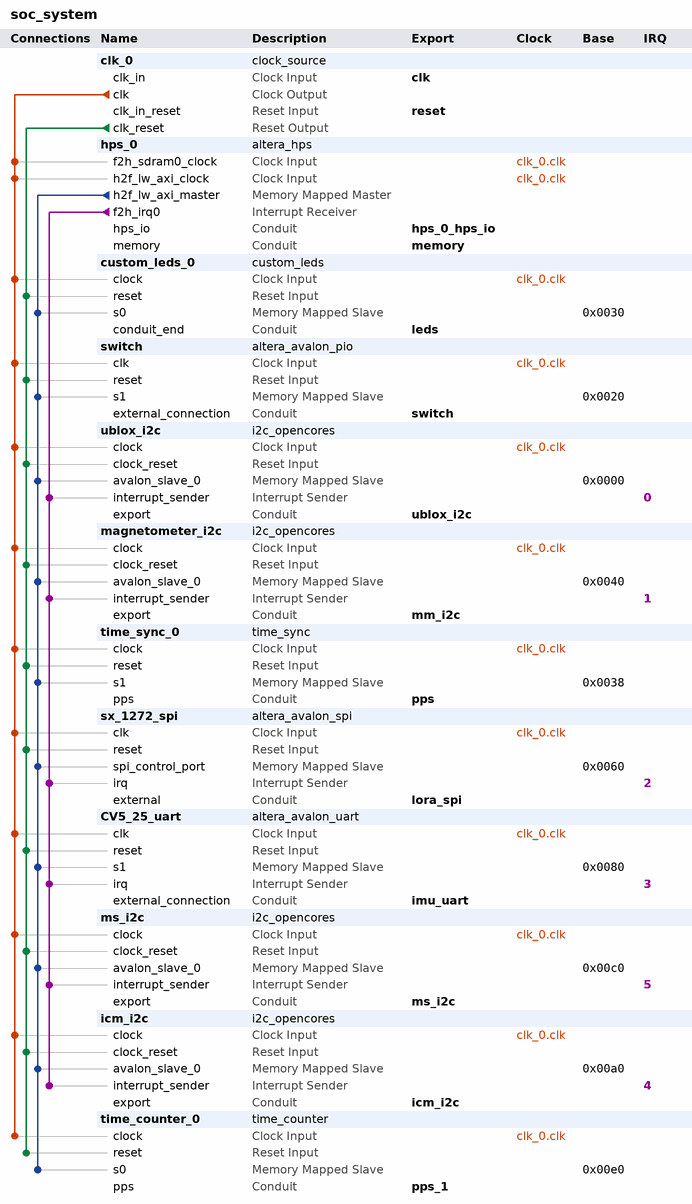
[diagram p0: system contents]
# Platform Designer (Qsys) system soc_system, Cyclone V 5CSEBA6U23I7
# Parameters at their usual value, and those the tool derives, are not listed.
package require -exact qsys 18.1
create_system soc_system
set_project_property DEVICE_FAMILY {Cyclone V}
set_project_property DEVICE 5CSEBA6U23I7

add_instance clk_0 clock_source 18.1
set_instance_parameter_value clk_0 clockFrequency 50000000

add_instance hps_0 altera_hps 18.1
set_instance_parameter_value hps_0 EMAC1_Mode RGMII
set_instance_parameter_value hps_0 EMAC1_PinMuxing {HPS I/O Set 0}
set_instance_parameter_value hps_0 F2SCLK_COLDRST_Enable false
set_instance_parameter_value hps_0 F2SCLK_DBGRST_Enable false
set_instance_parameter_value hps_0 F2SCLK_WARMRST_Enable false
set_instance_parameter_value hps_0 F2SDRAM_Type {Avalon-MM Bidirectional}
set_instance_parameter_value hps_0 F2SDRAM_Width 256
set_instance_parameter_value hps_0 F2SINTERRUPT_Enable true
set_instance_parameter_value hps_0 F2S_Width 0
set_instance_parameter_value hps_0 FPGA_PERIPHERAL_OUTPUT_CLOCK_FREQ_EMAC0_GTX_CLK 100
set_instance_parameter_value hps_0 FPGA_PERIPHERAL_OUTPUT_CLOCK_FREQ_EMAC0_MD_CLK 100.0
set_instance_parameter_value hps_0 FPGA_PERIPHERAL_OUTPUT_CLOCK_FREQ_EMAC1_GTX_CLK 100
set_instance_parameter_value hps_0 FPGA_PERIPHERAL_OUTPUT_CLOCK_FREQ_EMAC1_MD_CLK 100.0
set_instance_parameter_value hps_0 HPS_PROTOCOL DDR3
set_instance_parameter_value hps_0 I2C0_Mode N/A
set_instance_parameter_value hps_0 I2C0_PinMuxing Unused
set_instance_parameter_value hps_0 I2C1_Mode N/A
set_instance_parameter_value hps_0 I2C1_PinMuxing Unused
set_instance_parameter_value hps_0 LWH2F_Enable true
set_instance_parameter_value hps_0 MEM_BANKADDR_WIDTH 3
set_instance_parameter_value hps_0 MEM_CLK_FREQ 400.0
set_instance_parameter_value hps_0 MEM_COL_ADDR_WIDTH 10
set_instance_parameter_value hps_0 MEM_DQ_WIDTH 32
set_instance_parameter_value hps_0 MEM_DRV_STR RZQ/6
set_instance_parameter_value hps_0 MEM_ROW_ADDR_WIDTH 15
set_instance_parameter_value hps_0 MEM_RTT_NOM RZQ/6
set_instance_parameter_value hps_0 MEM_RTT_WR {Dynamic ODT off}
set_instance_parameter_value hps_0 MEM_TCL 7
set_instance_parameter_value hps_0 MEM_TFAW_NS 37.5
set_instance_parameter_value hps_0 MEM_TRAS_NS 35.0
set_instance_parameter_value hps_0 MEM_TRCD_NS 13.75
set_instance_parameter_value hps_0 MEM_TRFC_NS 300.0
set_instance_parameter_value hps_0 MEM_TRP_NS 13.75
set_instance_parameter_value hps_0 MEM_VENDOR Other
set_instance_parameter_value hps_0 MEM_WTCL 7
set_instance_parameter_value hps_0 QSPI_Mode N/A
set_instance_parameter_value hps_0 QSPI_PinMuxing Unused
set_instance_parameter_value hps_0 REF_CLK_FREQ 25.0
set_instance_parameter_value hps_0 S2FCLK_USER2CLK 4
set_instance_parameter_value hps_0 S2F_Width 0
set_instance_parameter_value hps_0 SDIO_Mode {4-bit Data}
set_instance_parameter_value hps_0 SDIO_PinMuxing {HPS I/O Set 0}
set_instance_parameter_value hps_0 SPIM1_Mode N/A
set_instance_parameter_value hps_0 SPIM1_PinMuxing Unused
set_instance_parameter_value hps_0 STM_Enable false
set_instance_parameter_value hps_0 TIMING_BOARD_AC_SKEW 0.02
set_instance_parameter_value hps_0 TIMING_BOARD_AC_TO_CK_SKEW 0.0
set_instance_parameter_value hps_0 TIMING_BOARD_DQ_TO_DQS_SKEW 0.0
set_instance_parameter_value hps_0 TIMING_BOARD_MAX_CK_DELAY 0.6
set_instance_parameter_value hps_0 TIMING_BOARD_MAX_DQS_DELAY 0.6
set_instance_parameter_value hps_0 TIMING_BOARD_SKEW_BETWEEN_DQS 0.02
set_instance_parameter_value hps_0 TIMING_BOARD_SKEW_CKDQS_DIMM_MAX 0.01
set_instance_parameter_value hps_0 TIMING_BOARD_SKEW_CKDQS_DIMM_MIN -0.01
set_instance_parameter_value hps_0 TIMING_BOARD_SKEW_WITHIN_DQS 0.02
set_instance_parameter_value hps_0 TIMING_TDH 125
set_instance_parameter_value hps_0 TIMING_TDQSCK 400
set_instance_parameter_value hps_0 TIMING_TDQSQ 120
set_instance_parameter_value hps_0 TIMING_TDS 50
set_instance_parameter_value hps_0 TIMING_TIH 250
set_instance_parameter_value hps_0 TIMING_TIS 175
set_instance_parameter_value hps_0 TIMING_TQSH 0.38
set_instance_parameter_value hps_0 UART0_Mode {No Flow Control}
set_instance_parameter_value hps_0 UART0_PinMuxing {HPS I/O Set 0}
set_instance_parameter_value hps_0 USB1_Mode N/A
set_instance_parameter_value hps_0 USB1_PinMuxing Unused
set_instance_parameter_value hps_0 desired_cfg_clk_mhz 100.0
set_instance_parameter_value hps_0 desired_qspi_clk_mhz 370.0

add_instance custom_leds_0 custom_leds 1.0

add_instance switch altera_avalon_pio 18.1
set_instance_parameter_value switch direction Input
set_instance_parameter_value switch width 4

add_instance ublox_i2c i2c_opencores 12.0

add_instance magnetometer_i2c i2c_opencores 12.0

add_instance time_sync_0 time_sync 1.0

add_instance sx_1272_spi altera_avalon_spi 18.1
set_instance_parameter_value sx_1272_spi clockPolarity 0
set_instance_parameter_value sx_1272_spi dataWidth 8
set_instance_parameter_value sx_1272_spi masterSPI true
set_instance_parameter_value sx_1272_spi numberOfSlaves 1
set_instance_parameter_value sx_1272_spi targetClockRate 5000000

add_instance CV5_25_uart altera_avalon_uart 18.1
set_instance_parameter_value CV5_25_uart baud 115200
set_instance_parameter_value CV5_25_uart dataBits 8
set_instance_parameter_value CV5_25_uart fixedBaud true
set_instance_parameter_value CV5_25_uart parity NONE
set_instance_parameter_value CV5_25_uart stopBits 1

add_instance ms_i2c i2c_opencores 12.0

add_instance icm_i2c i2c_opencores 12.0

add_instance time_counter_0 time_counter 1.0

# connections
add_connection clk_0.clk custom_leds_0.clock clock
add_connection clk_0.clk CV5_25_uart.clk clock
add_connection clk_0.clk hps_0.f2h_sdram0_clock clock
add_connection clk_0.clk hps_0.h2f_lw_axi_clock clock
add_connection clk_0.clk icm_i2c.clock clock
add_connection clk_0.clk magnetometer_i2c.clock clock
add_connection clk_0.clk ms_i2c.clock clock
add_connection clk_0.clk switch.clk clock
add_connection clk_0.clk sx_1272_spi.clk clock
add_connection clk_0.clk time_counter_0.clock clock
add_connection clk_0.clk time_sync_0.clock clock
add_connection clk_0.clk ublox_i2c.clock clock
add_connection clk_0.clk_reset custom_leds_0.reset reset
add_connection clk_0.clk_reset CV5_25_uart.reset reset
add_connection clk_0.clk_reset icm_i2c.clock_reset reset
add_connection clk_0.clk_reset magnetometer_i2c.clock_reset reset
add_connection clk_0.clk_reset ms_i2c.clock_reset reset
add_connection clk_0.clk_reset switch.reset reset
add_connection clk_0.clk_reset sx_1272_spi.reset reset
add_connection clk_0.clk_reset time_counter_0.reset reset
add_connection clk_0.clk_reset time_sync_0.reset reset
add_connection clk_0.clk_reset ublox_i2c.clock_reset reset
add_connection hps_0.h2f_lw_axi_master custom_leds_0.s0 avalon
set_connection_parameter_value hps_0.h2f_lw_axi_master/custom_leds_0.s0 baseAddress 0x0030
add_connection hps_0.h2f_lw_axi_master CV5_25_uart.s1 avalon
set_connection_parameter_value hps_0.h2f_lw_axi_master/CV5_25_uart.s1 baseAddress 0x0080
add_connection hps_0.h2f_lw_axi_master icm_i2c.avalon_slave_0 avalon
set_connection_parameter_value hps_0.h2f_lw_axi_master/icm_i2c.avalon_slave_0 baseAddress 0x00a0
add_connection hps_0.h2f_lw_axi_master magnetometer_i2c.avalon_slave_0 avalon
set_connection_parameter_value hps_0.h2f_lw_axi_master/magnetometer_i2c.avalon_slave_0 baseAddress 0x0040
add_connection hps_0.h2f_lw_axi_master ms_i2c.avalon_slave_0 avalon
set_connection_parameter_value hps_0.h2f_lw_axi_master/ms_i2c.avalon_slave_0 baseAddress 0x00c0
add_connection hps_0.h2f_lw_axi_master switch.s1 avalon
set_connection_parameter_value hps_0.h2f_lw_axi_master/switch.s1 baseAddress 0x0020
add_connection hps_0.h2f_lw_axi_master sx_1272_spi.spi_control_port avalon
set_connection_parameter_value hps_0.h2f_lw_axi_master/sx_1272_spi.spi_control_port baseAddress 0x0060
add_connection hps_0.h2f_lw_axi_master time_counter_0.s0 avalon
set_connection_parameter_value hps_0.h2f_lw_axi_master/time_counter_0.s0 baseAddress 0x00e0
add_connection hps_0.h2f_lw_axi_master time_sync_0.s1 avalon
set_connection_parameter_value hps_0.h2f_lw_axi_master/time_sync_0.s1 baseAddress 0x0038
add_connection hps_0.h2f_lw_axi_master ublox_i2c.avalon_slave_0 avalon
set_connection_parameter_value hps_0.h2f_lw_axi_master/ublox_i2c.avalon_slave_0 baseAddress 0x0000
add_connection hps_0.f2h_irq0 CV5_25_uart.irq interrupt
set_connection_parameter_value hps_0.f2h_irq0/CV5_25_uart.irq irqNumber 3
add_connection hps_0.f2h_irq0 icm_i2c.interrupt_sender interrupt
set_connection_parameter_value hps_0.f2h_irq0/icm_i2c.interrupt_sender irqNumber 4
add_connection hps_0.f2h_irq0 magnetometer_i2c.interrupt_sender interrupt
set_connection_parameter_value hps_0.f2h_irq0/magnetometer_i2c.interrupt_sender irqNumber 1
add_connection hps_0.f2h_irq0 ms_i2c.interrupt_sender interrupt
set_connection_parameter_value hps_0.f2h_irq0/ms_i2c.interrupt_sender irqNumber 5
add_connection hps_0.f2h_irq0 sx_1272_spi.irq interrupt
set_connection_parameter_value hps_0.f2h_irq0/sx_1272_spi.irq irqNumber 2
add_connection hps_0.f2h_irq0 ublox_i2c.interrupt_sender interrupt
set_connection_parameter_value hps_0.f2h_irq0/ublox_i2c.interrupt_sender irqNumber 0

# exported interfaces
add_interface clk clock sink
set_interface_property clk EXPORT_OF clk_0.clk_in
add_interface hps_0_hps_io conduit end
set_interface_property hps_0_hps_io EXPORT_OF hps_0.hps_io
add_interface icm_i2c conduit end
set_interface_property icm_i2c EXPORT_OF icm_i2c.export
add_interface imu_uart conduit end
set_interface_property imu_uart EXPORT_OF CV5_25_uart.external_connection
add_interface leds conduit end
set_interface_property leds EXPORT_OF custom_leds_0.conduit_end
add_interface lora_spi conduit end
set_interface_property lora_spi EXPORT_OF sx_1272_spi.external
add_interface memory conduit end
set_interface_property memory EXPORT_OF hps_0.memory
add_interface mm_i2c conduit end
set_interface_property mm_i2c EXPORT_OF magnetometer_i2c.export
add_interface ms_i2c conduit end
set_interface_property ms_i2c EXPORT_OF ms_i2c.export
add_interface pps conduit end
set_interface_property pps EXPORT_OF time_sync_0.pps
add_interface pps_1 conduit end
set_interface_property pps_1 EXPORT_OF time_counter_0.pps
add_interface reset reset sink
set_interface_property reset EXPORT_OF clk_0.clk_in_reset
add_interface switch conduit end
set_interface_property switch EXPORT_OF switch.external_connection
add_interface ublox_i2c conduit end
set_interface_property ublox_i2c EXPORT_OF ublox_i2c.export

set_interconnect_requirement {$system} qsys_mm.clockCrossingAdapter HANDSHAKE
set_interconnect_requirement {$system} qsys_mm.maxAdditionalLatency 1

save_system soc_system.qsys
